# EAGLE board ROM (EAGLE 7.3.0)
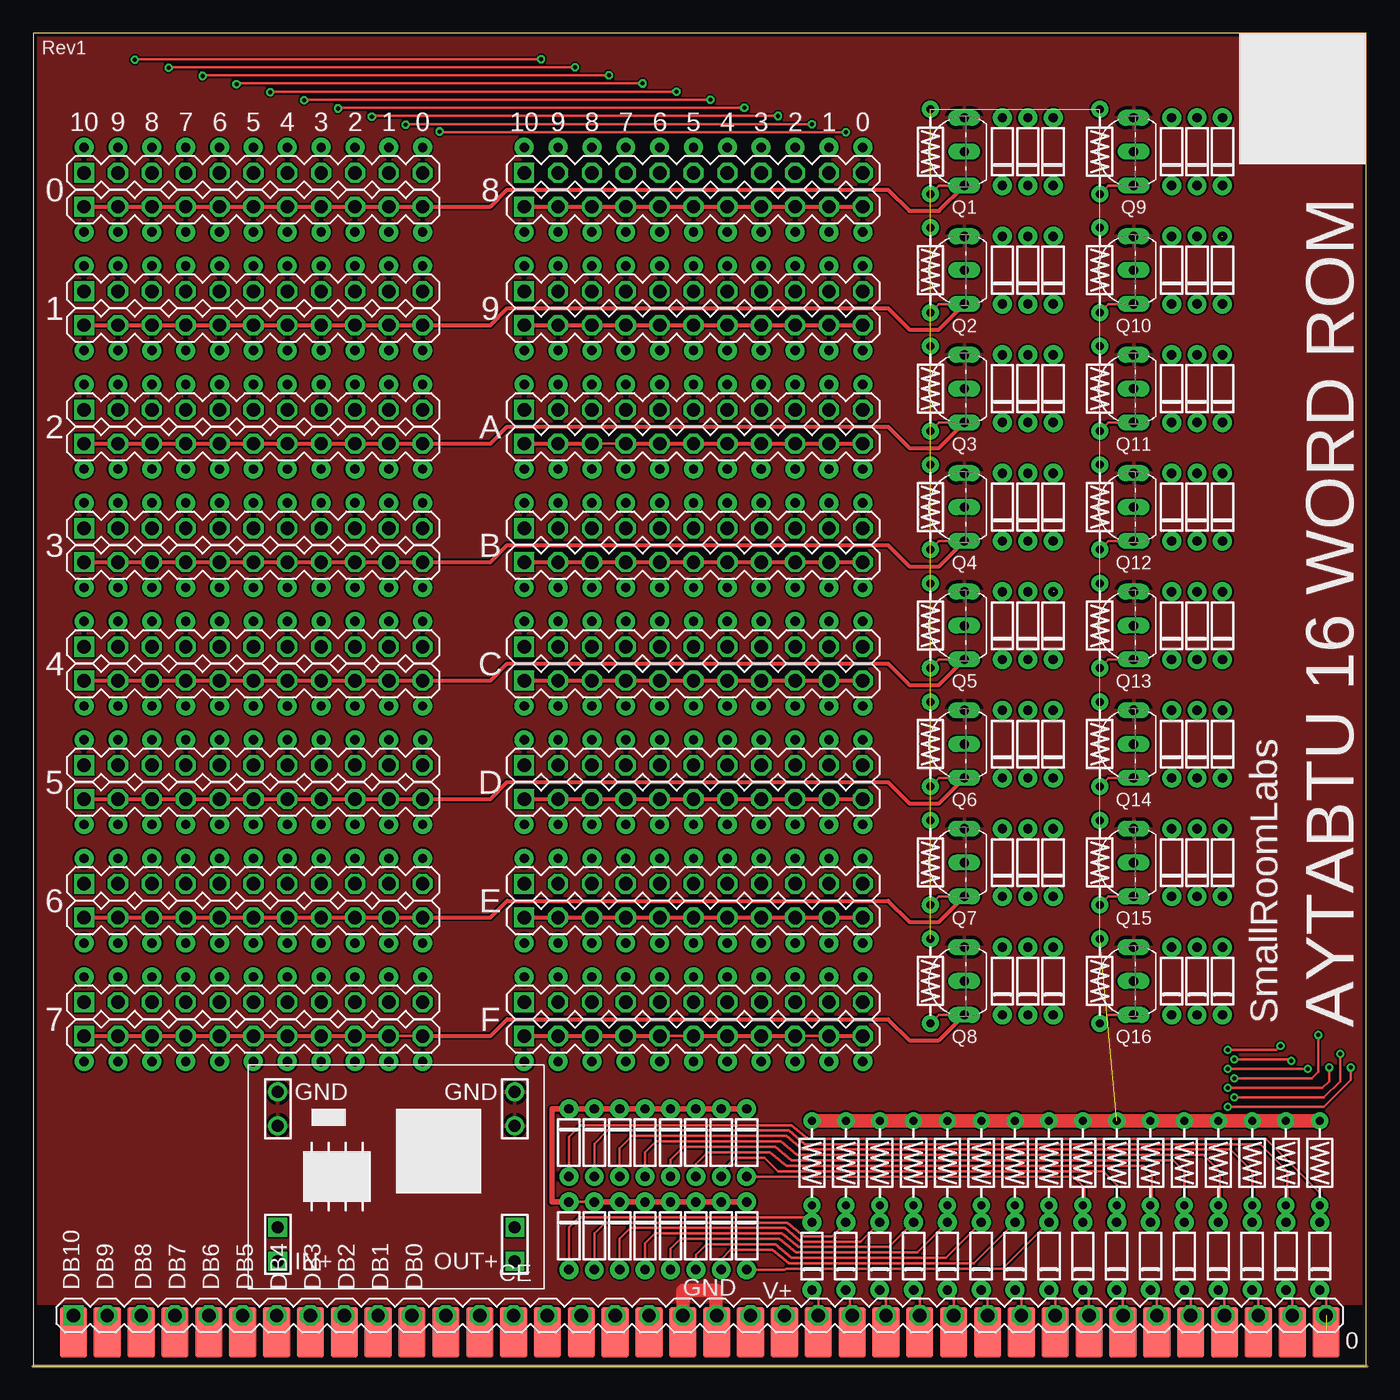
[diagram p1: board, top side]
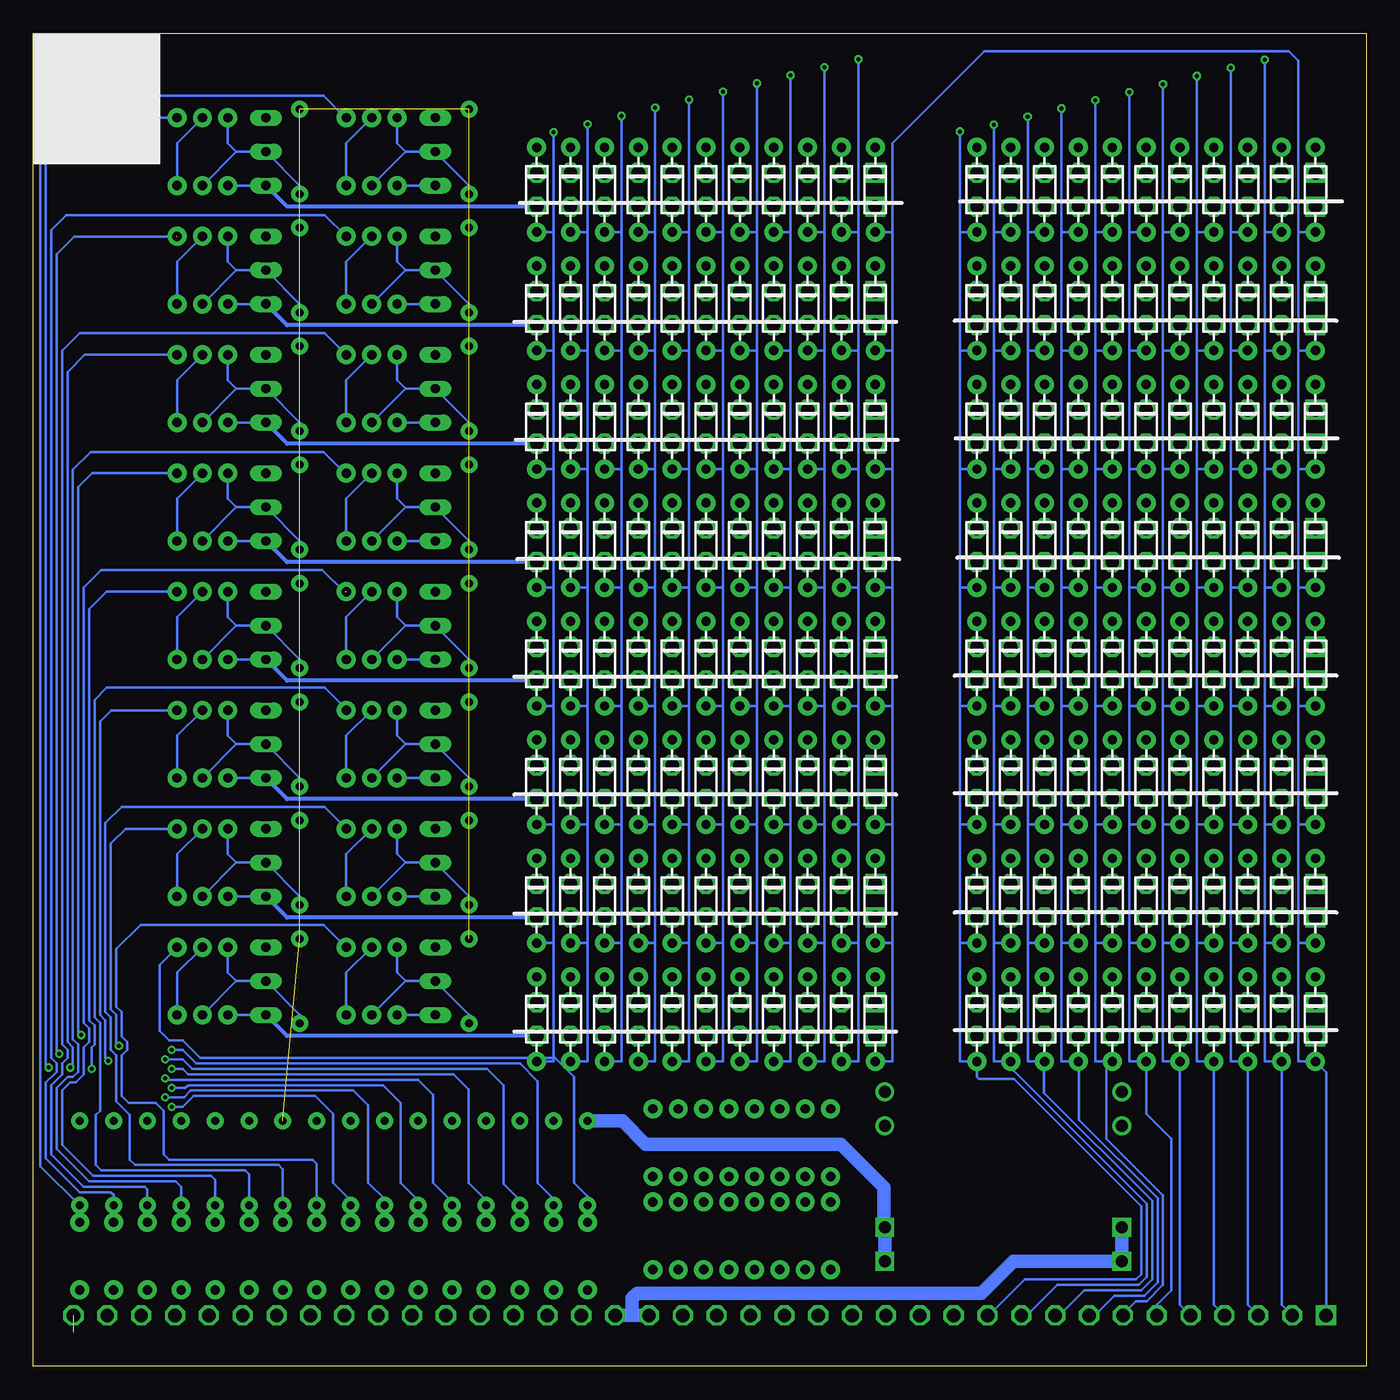
[diagram p2: board, bottom side, seen from below]

Size 100 x 100 mm. Coordinates in mm from the lower left corner, seen from the top.
Outline: 0,0 100,0 100,100 0,100 0,0
Copper layers (1*16): Top 0.035mm / dielectric 1.5mm / Bottom 0.035mm
Design rules "dirt_cheap_dirty_boards.v1": minimum track width 5mil, minimum drill 12mil, track to track 5mil, track to pad 5mil, pad to pad 5mil, via to via 5mil, smd to smd 0mil, copper to edge 10mil, drill to drill 10mil, minimum pad ring 10mil, minimum via ring 6mil, stop-mask expansion 2mil, vias tented up to drill 25mil, thermal gap 10mil

## Footprints (pad centres in the part's own frame; a part is rotated, then mirrored left to right if it is on the bottom)
HD11 = drill 1 square: P$1 -12.7,0 | drill 1 octagon: P$2 -10.16,0; P$3 -7.62,0; P$4 -5.08,0; P$5 -2.54,0; P$6 0,0; P$7 2.54,0; P$8 5.08,0; P$9 7.62,0; P$10 10.16,0; P$11 12.7,0
HD38-HOLEPAD = drill 1 square: P1@1 -46.99,0 | smd 2.032 x 3.81: P1@2 -46.99,-1.27; P2@2 -44.45,-1.27; P3@2 -41.91,-1.27; P4@2 -39.37,-1.27; P5@2 -36.83,-1.27; P6@2 -34.29,-1.27; P7@2 -31.75,-1.27; P8@2 -29.21,-1.27; P9@2 -26.67,-1.27; P10@2 -24.13,-1.27; P11@2 -21.59,-1.27; P12@2 -19.05,-1.27; P13@2 -16.51,-1.27; P14@2 -13.97,-1.27; P15@2 -11.43,-1.27; P16@2 -8.89,-1.27; P17@2 -6.35,-1.27; P18@2 -3.81,-1.27; P19@2 -1.27,-1.27; P20@2 1.27,-1.27; P21@2 3.81,-1.27; P22@2 6.35,-1.27; P23@2 8.89,-1.27; P24@2 11.43,-1.27; P25@2 13.97,-1.27; P26@2 16.51,-1.27; P27@2 19.05,-1.27; P28@2 21.59,-1.27; P29@2 24.13,-1.27; P30@2 26.67,-1.27; P31@2 29.21,-1.27; P32@2 31.75,-1.27; P33@2 34.29,-1.27; P34@2 36.83,-1.27; P35@2 39.37,-1.27; P36@2 41.91,-1.27; P37@2 44.45,-1.27; P38@2 46.99,-1.27 | drill 1 octagon: P2@1 -44.45,0; P3@1 -41.91,0; P4@1 -39.37,0; P5@1 -36.83,0; P6@1 -34.29,0; P7@1 -31.75,0; P8@1 -29.21,0; P9@1 -26.67,0; P10@1 -24.13,0; P11@1 -21.59,0; P12@1 -19.05,0; P13@1 -16.51,0; P14@1 -13.97,0; P15@1 -11.43,0; P16@1 -8.89,0; P17@1 -6.35,0; P18@1 -3.81,0; P19@1 -1.27,0; P20@1 1.27,0; P21@1 3.81,0; P22@1 6.35,0; P23@1 8.89,0; P24@1 11.43,0; P25@1 13.97,0; P26@1 16.51,0; P27@1 19.05,0; P28@1 21.59,0; P29@1 24.13,0; P30@1 26.67,0; P31@1 29.21,0; P32@1 31.75,0; P33@1 34.29,0; P34@1 36.83,0; P35@1 39.37,0; P36@1 41.91,0; P37@1 44.45,0; P38@1 46.99,0
DO35-6.3 = drill 0.7 pad 1.422: A -3.175,0; C 3.175,0
DO35-5.08 = drill 0.7 pad 1.422: A -2.54,0; C 2.54,0
TO92-S-CBE = drill 0.7 long: B 0,0; C -2.54,0; E 2.54,0
R0125-6.3 = drill 0.6 pad 1.27: 1 -3.175,0; 2 3.175,0
BUCK1722 = drill 0.9: GND@1 -8.89,6.35; GND@2 -8.89,3.81; GND@3 8.89,6.35; GND@4 8.89,3.81 | drill 0.9 square: IN@1 -8.89,-3.81; IN@2 -8.89,-6.35; OUT@1 8.89,-3.81; OUT@2 8.89,-6.35

## Placement (x,y rotation side)
CN1  HD11  [HD11]  16.51,89.53 0 top
CN2  HD11  [HD11]  16.51,87 0 top
CN3  HD11  [HD11]  16.51,80.64 0 top
CN4  HD11  [HD11]  16.51,78.11 0 top
CN5  HD11  [HD11]  16.51,71.75 0 top
CN6  HD11  [HD11]  16.51,69.22 0 top
CN7  HD11  [HD11]  16.51,53.98 0 top
CN8  HD11  [HD11]  16.51,62.87 0 top
CN9  HD11  [HD11]  16.51,60.33 0 top
CN10  HD11  [HD11]  16.51,51.44 0 top
CN11  HD11  [HD11]  49.53,89.53 0 top
CN12  HD11  [HD11]  16.51,45.09 0 top
CN13  HD11  [HD11]  16.51,42.55 0 top
CN14  HD11  [HD11]  16.51,36.2 0 top
CN15  HD11  [HD11]  16.51,33.66 0 top
CN16  HD11  [HD11]  16.51,27.3 0 top
CN17  HD11  [HD11]  16.51,24.77 0 top
CN18  HD11  [HD11]  49.53,87 0 top
CN20  HD11  [HD11]  49.53,80.64 0 top
CN21  HD11  [HD11]  49.53,78.11 0 top
CN22  HD11  [HD11]  49.53,71.75 0 top
CN23  HD11  [HD11]  49.53,69.22 0 top
CN24  HD11  [HD11]  49.53,62.87 0 top
CN25  HD11  [HD11]  49.53,60.33 0 top
CN26  HD11  [HD11]  49.53,53.98 0 top
CN27  HD11  [HD11]  49.53,51.44 0 top
CN28  HD11  [HD11]  49.53,45.09 0 top
CN29  HD11  [HD11]  49.53,42.55 0 top
CN30  HD11  [HD11]  49.53,36.2 0 top
CN31  HD11  [HD11]  49.53,33.66 0 top
CN32  HD11  [HD11]  49.53,27.3 0 top
CN33  HD11  [HD11]  49.53,24.77 0 top
CN35  HD38-HP  [HD38-HOLEPAD]  50,3.81 0 top
D1  DIODE-6.3  [DO35-6.3]  3.81,88.27 90 bottom
D2  DIODE-6.3  [DO35-6.3]  6.35,88.27 90 bottom
D3  DIODE-6.3  [DO35-6.3]  8.89,88.27 90 bottom
D4  DIODE-6.3  [DO35-6.3]  11.43,88.27 90 bottom
D5  DIODE-6.3  [DO35-6.3]  13.97,88.27 90 bottom
D6  DIODE-6.3  [DO35-6.3]  16.51,88.27 90 bottom
D7  DIODE-6.3  [DO35-6.3]  19.05,88.27 90 bottom
D8  DIODE-6.3  [DO35-6.3]  21.59,88.27 90 bottom
D9  DIODE-6.3  [DO35-6.3]  24.13,88.27 90 bottom
D10  DIODE-6.3  [DO35-6.3]  26.67,88.27 90 bottom
D11  DIODE-6.3  [DO35-6.3]  29.21,88.27 90 bottom
D12  DIODE-6.3  [DO35-6.3]  3.81,79.38 90 bottom
D13  DIODE-6.3  [DO35-6.3]  6.35,79.38 90 bottom
D14  DIODE-6.3  [DO35-6.3]  8.89,79.38 90 bottom
D15  DIODE-6.3  [DO35-6.3]  11.43,79.38 90 bottom
D16  DIODE-6.3  [DO35-6.3]  13.97,79.38 90 bottom
D17  DIODE-6.3  [DO35-6.3]  16.51,79.38 90 bottom
D18  DIODE-6.3  [DO35-6.3]  19.05,79.38 90 bottom
D19  DIODE-6.3  [DO35-6.3]  21.59,79.38 90 bottom
D20  DIODE-6.3  [DO35-6.3]  24.13,79.38 90 bottom
D21  DIODE-6.3  [DO35-6.3]  26.67,79.38 90 bottom
D22  DIODE-6.3  [DO35-6.3]  29.21,79.38 90 bottom
D23  DIODE-6.3  [DO35-6.3]  3.81,70.48 90 bottom
D24  DIODE-6.3  [DO35-6.3]  6.35,70.48 90 bottom
D25  DIODE-6.3  [DO35-6.3]  8.89,70.48 90 bottom
D26  DIODE-6.3  [DO35-6.3]  11.43,70.48 90 bottom
D27  DIODE-6.3  [DO35-6.3]  13.97,70.48 90 bottom
D28  DIODE-6.3  [DO35-6.3]  16.51,70.48 90 bottom
D29  DIODE-6.3  [DO35-6.3]  19.05,70.48 90 bottom
D30  DIODE-6.3  [DO35-6.3]  21.59,70.48 90 bottom
D31  DIODE-6.3  [DO35-6.3]  24.13,70.48 90 bottom
D32  DIODE-6.3  [DO35-6.3]  26.67,70.48 90 bottom
D33  DIODE-6.3  [DO35-6.3]  29.21,70.48 90 bottom
D34  DIODE-6.3  [DO35-6.3]  3.81,61.59 90 bottom
D35  DIODE-6.3  [DO35-6.3]  6.35,61.59 90 bottom
D36  DIODE-6.3  [DO35-6.3]  8.89,61.59 90 bottom
D37  DIODE-6.3  [DO35-6.3]  11.43,61.59 90 bottom
D38  DIODE-6.3  [DO35-6.3]  13.97,61.59 90 bottom
D39  DIODE-6.3  [DO35-6.3]  16.51,61.59 90 bottom
D40  DIODE-6.3  [DO35-6.3]  19.05,61.59 90 bottom
D41  DIODE-6.3  [DO35-6.3]  21.59,61.59 90 bottom
D42  DIODE-6.3  [DO35-6.3]  24.13,61.59 90 bottom
D43  DIODE-6.3  [DO35-6.3]  26.67,61.59 90 bottom
D44  DIODE-6.3  [DO35-6.3]  29.21,61.59 90 bottom
D45  DIODE-6.3  [DO35-6.3]  3.81,52.7 90 bottom
D46  DIODE-6.3  [DO35-6.3]  6.35,52.7 90 bottom
D47  DIODE-6.3  [DO35-6.3]  8.89,52.7 90 bottom
D48  DIODE-6.3  [DO35-6.3]  11.43,52.7 90 bottom
D49  DIODE-6.3  [DO35-6.3]  13.97,52.7 90 bottom
D50  DIODE-6.3  [DO35-6.3]  16.51,52.7 90 bottom
D51  DIODE-6.3  [DO35-6.3]  19.05,52.7 90 bottom
D52  DIODE-6.3  [DO35-6.3]  21.59,52.7 90 bottom
D53  DIODE-6.3  [DO35-6.3]  24.13,52.7 90 bottom
D54  DIODE-6.3  [DO35-6.3]  26.67,52.7 90 bottom
D55  DIODE-6.3  [DO35-6.3]  29.21,52.7 90 bottom
D56  DIODE-6.3  [DO35-6.3]  3.81,43.81 90 bottom
D57  DIODE-6.3  [DO35-6.3]  6.35,43.81 90 bottom
D58  DIODE-6.3  [DO35-6.3]  8.89,43.81 90 bottom
D59  DIODE-6.3  [DO35-6.3]  11.43,43.81 90 bottom
D60  DIODE-6.3  [DO35-6.3]  13.97,43.81 90 bottom
D61  DIODE-6.3  [DO35-6.3]  16.51,43.81 90 bottom
D62  DIODE-6.3  [DO35-6.3]  19.05,43.81 90 bottom
D63  DIODE-6.3  [DO35-6.3]  21.59,43.81 90 bottom
D64  DIODE-6.3  [DO35-6.3]  24.13,43.81 90 bottom
D65  DIODE-6.3  [DO35-6.3]  26.67,43.81 90 bottom
D66  DIODE-6.3  [DO35-6.3]  29.21,43.81 90 bottom
D67  DIODE-6.3  [DO35-6.3]  3.81,34.92 90 bottom
D68  DIODE-6.3  [DO35-6.3]  6.35,34.92 90 bottom
D69  DIODE-6.3  [DO35-6.3]  8.89,34.92 90 bottom
D70  DIODE-6.3  [DO35-6.3]  11.43,34.92 90 bottom
D71  DIODE-6.3  [DO35-6.3]  13.97,34.92 90 bottom
D72  DIODE-6.3  [DO35-6.3]  16.51,34.92 90 bottom
D73  DIODE-6.3  [DO35-6.3]  19.05,34.92 90 bottom
D74  DIODE-6.3  [DO35-6.3]  21.59,34.92 90 bottom
D75  DIODE-6.3  [DO35-6.3]  24.13,34.92 90 bottom
D76  DIODE-6.3  [DO35-6.3]  26.67,34.92 90 bottom
D77  DIODE-6.3  [DO35-6.3]  29.21,34.92 90 bottom
D78  DIODE-6.3  [DO35-6.3]  3.81,26.04 90 bottom
D79  DIODE-6.3  [DO35-6.3]  6.35,26.04 90 bottom
D80  DIODE-6.3  [DO35-6.3]  8.89,26.04 90 bottom
D81  DIODE-6.3  [DO35-6.3]  11.43,26.04 90 bottom
D82  DIODE-6.3  [DO35-6.3]  13.97,26.04 90 bottom
D83  DIODE-6.3  [DO35-6.3]  16.51,26.04 90 bottom
D84  DIODE-6.3  [DO35-6.3]  19.05,26.04 90 bottom
D85  DIODE-6.3  [DO35-6.3]  21.59,26.04 90 bottom
D86  DIODE-6.3  [DO35-6.3]  24.13,26.04 90 bottom
D87  DIODE-6.3  [DO35-6.3]  26.67,26.04 90 bottom
D88  DIODE-6.3  [DO35-6.3]  29.21,26.04 90 bottom
D89  DIODE-6.3  [DO35-6.3]  36.83,88.27 90 bottom
D90  DIODE-6.3  [DO35-6.3]  39.37,88.27 90 bottom
D91  DIODE-6.3  [DO35-6.3]  41.91,88.27 90 bottom
D92  DIODE-6.3  [DO35-6.3]  44.45,88.27 90 bottom
D93  DIODE-6.3  [DO35-6.3]  46.99,88.27 90 bottom
D94  DIODE-6.3  [DO35-6.3]  49.53,88.27 90 bottom
D95  DIODE-6.3  [DO35-6.3]  52.07,88.27 90 bottom
D96  DIODE-6.3  [DO35-6.3]  54.61,88.27 90 bottom
D97  DIODE-6.3  [DO35-6.3]  57.15,88.27 90 bottom
D98  DIODE-6.3  [DO35-6.3]  59.69,88.27 90 bottom
D99  DIODE-6.3  [DO35-6.3]  62.23,88.27 90 bottom
D100  DIODE-6.3  [DO35-6.3]  36.83,79.38 90 bottom
D101  DIODE-6.3  [DO35-6.3]  39.37,79.38 90 bottom
D102  DIODE-6.3  [DO35-6.3]  41.91,79.38 90 bottom
D103  DIODE-6.3  [DO35-6.3]  44.45,79.38 90 bottom
D104  DIODE-6.3  [DO35-6.3]  46.99,79.38 90 bottom
D105  DIODE-6.3  [DO35-6.3]  49.53,79.38 90 bottom
D106  DIODE-6.3  [DO35-6.3]  52.07,79.38 90 bottom
D107  DIODE-6.3  [DO35-6.3]  54.61,79.38 90 bottom
D108  DIODE-6.3  [DO35-6.3]  57.15,79.38 90 bottom
D109  DIODE-6.3  [DO35-6.3]  59.69,79.38 90 bottom
D110  DIODE-6.3  [DO35-6.3]  62.23,79.38 90 bottom
D111  DIODE-6.3  [DO35-6.3]  36.83,70.48 90 bottom
D112  DIODE-6.3  [DO35-6.3]  39.37,70.48 90 bottom
D113  DIODE-6.3  [DO35-6.3]  41.91,70.48 90 bottom
D114  DIODE-6.3  [DO35-6.3]  44.45,70.48 90 bottom
D115  DIODE-6.3  [DO35-6.3]  46.99,70.48 90 bottom
D116  DIODE-6.3  [DO35-6.3]  49.53,70.48 90 bottom
D117  DIODE-6.3  [DO35-6.3]  52.07,70.48 90 bottom
D118  DIODE-6.3  [DO35-6.3]  54.61,70.48 90 bottom
D119  DIODE-6.3  [DO35-6.3]  57.15,70.48 90 bottom
D120  DIODE-6.3  [DO35-6.3]  59.69,70.48 90 bottom
D121  DIODE-6.3  [DO35-6.3]  62.23,70.48 90 bottom
D122  DIODE-6.3  [DO35-6.3]  36.83,61.59 90 bottom
D123  DIODE-6.3  [DO35-6.3]  39.37,61.59 90 bottom
D124  DIODE-6.3  [DO35-6.3]  41.91,61.59 90 bottom
D125  DIODE-6.3  [DO35-6.3]  44.45,61.59 90 bottom
D126  DIODE-6.3  [DO35-6.3]  46.99,61.59 90 bottom
D127  DIODE-6.3  [DO35-6.3]  49.53,61.59 90 bottom
D128  DIODE-6.3  [DO35-6.3]  52.07,61.59 90 bottom
D129  DIODE-6.3  [DO35-6.3]  54.61,61.59 90 bottom
D130  DIODE-6.3  [DO35-6.3]  57.15,61.59 90 bottom
D131  DIODE-6.3  [DO35-6.3]  59.69,61.59 90 bottom
D132  DIODE-6.3  [DO35-6.3]  62.23,61.59 90 bottom
D133  DIODE-6.3  [DO35-6.3]  36.83,52.7 90 bottom
D134  DIODE-6.3  [DO35-6.3]  39.37,52.7 90 bottom
D135  DIODE-6.3  [DO35-6.3]  41.91,52.7 90 bottom
D136  DIODE-6.3  [DO35-6.3]  44.45,52.7 90 bottom
D137  DIODE-6.3  [DO35-6.3]  46.99,52.7 90 bottom
D138  DIODE-6.3  [DO35-6.3]  49.53,52.7 90 bottom
D139  DIODE-6.3  [DO35-6.3]  52.07,52.7 90 bottom
D140  DIODE-6.3  [DO35-6.3]  54.61,52.7 90 bottom
D141  DIODE-6.3  [DO35-6.3]  57.15,52.7 90 bottom
D142  DIODE-6.3  [DO35-6.3]  59.69,52.7 90 bottom
D143  DIODE-6.3  [DO35-6.3]  62.23,52.7 90 bottom
D144  DIODE-6.3  [DO35-6.3]  36.83,43.81 90 bottom
D145  DIODE-6.3  [DO35-6.3]  39.37,43.81 90 bottom
D146  DIODE-6.3  [DO35-6.3]  41.91,43.81 90 bottom
D147  DIODE-6.3  [DO35-6.3]  44.45,43.81 90 bottom
D148  DIODE-6.3  [DO35-6.3]  46.99,43.81 90 bottom
D149  DIODE-6.3  [DO35-6.3]  49.53,43.81 90 bottom
D150  DIODE-6.3  [DO35-6.3]  52.07,43.81 90 bottom
D151  DIODE-6.3  [DO35-6.3]  54.61,43.81 90 bottom
D152  DIODE-6.3  [DO35-6.3]  57.15,43.81 90 bottom
D153  DIODE-6.3  [DO35-6.3]  59.69,43.81 90 bottom
D154  DIODE-6.3  [DO35-6.3]  62.23,43.81 90 bottom
D155  DIODE-6.3  [DO35-6.3]  36.83,34.92 90 bottom
D156  DIODE-6.3  [DO35-6.3]  39.37,34.92 90 bottom
D157  DIODE-6.3  [DO35-6.3]  41.91,34.92 90 bottom
D158  DIODE-6.3  [DO35-6.3]  44.45,34.92 90 bottom
D159  DIODE-6.3  [DO35-6.3]  46.99,34.92 90 bottom
D160  DIODE-6.3  [DO35-6.3]  49.53,34.92 90 bottom
D161  DIODE-6.3  [DO35-6.3]  52.07,34.92 90 bottom
D162  DIODE-6.3  [DO35-6.3]  54.61,34.92 90 bottom
D163  DIODE-6.3  [DO35-6.3]  57.15,34.92 90 bottom
D164  DIODE-6.3  [DO35-6.3]  59.69,34.92 90 bottom
D165  DIODE-6.3  [DO35-6.3]  62.23,34.92 90 bottom
D166  DIODE-6.3  [DO35-6.3]  36.83,26.04 90 bottom
D167  DIODE-6.3  [DO35-6.3]  39.37,26.04 90 bottom
D168  DIODE-6.3  [DO35-6.3]  41.91,26.04 90 bottom
D169  DIODE-6.3  [DO35-6.3]  44.45,26.04 90 bottom
D170  DIODE-6.3  [DO35-6.3]  46.99,26.04 90 bottom
D171  DIODE-6.3  [DO35-6.3]  49.53,26.04 90 bottom
D172  DIODE-6.3  [DO35-6.3]  52.07,26.04 90 bottom
D173  DIODE-6.3  [DO35-6.3]  54.61,26.04 90 bottom
D174  DIODE-6.3  [DO35-6.3]  57.15,26.04 90 bottom
D175  DIODE-6.3  [DO35-6.3]  59.69,26.04 90 bottom
D176  DIODE-6.3  [DO35-6.3]  62.23,26.04 90 bottom
D177  DIODE-5.08  [DO35-5.08]  74.61,91.12 270 top
D178  DIODE-5.08  [DO35-5.08]  76.52,91.12 270 top
D179  DIODE-5.08  [DO35-5.08]  58.42,8.26 270 top
D180  DIODE-5.08  [DO35-5.08]  60.96,8.26 270 top
D181  DIODE-5.08  [DO35-5.08]  72.71,91.12 270 top
D182  DIODE-5.08  [DO35-5.08]  40.18,9.78 90 top
D183  DIODE-5.08  [DO35-5.08]  42.09,9.78 90 top
D184  DIODE-5.08  [DO35-5.08]  43.99,9.78 90 top
D185  DIODE-5.08  [DO35-5.08]  45.9,9.78 90 top
D186  DIODE-5.08  [DO35-5.08]  47.8,9.78 90 top
D187  DIODE-5.08  [DO35-5.08]  49.71,9.78 90 top
D188  DIODE-5.08  [DO35-5.08]  51.61,9.78 90 top
D189  DIODE-5.08  [DO35-5.08]  53.52,9.78 90 top
D190  DIODE-5.08  [DO35-5.08]  53.52,16.76 90 top
D191  DIODE-5.08  [DO35-5.08]  51.61,16.76 90 top
D192  DIODE-5.08  [DO35-5.08]  49.71,16.76 90 top
D193  DIODE-5.08  [DO35-5.08]  47.8,16.76 90 top
D194  DIODE-5.08  [DO35-5.08]  45.9,16.76 90 top
D195  DIODE-5.08  [DO35-5.08]  43.99,16.76 90 top
D196  DIODE-5.08  [DO35-5.08]  42.09,16.76 90 top
D197  DIODE-5.08  [DO35-5.08]  40.18,16.76 90 top
D198  DIODE-5.08  [DO35-5.08]  63.5,8.26 270 top
D199  DIODE-5.08  [DO35-5.08]  66.04,8.26 270 top
D200  DIODE-5.08  [DO35-5.08]  68.58,8.26 270 top
D201  DIODE-5.08  [DO35-5.08]  71.12,8.26 270 top
D202  DIODE-5.08  [DO35-5.08]  73.66,8.26 270 top
D203  DIODE-5.08  [DO35-5.08]  76.2,8.26 270 top
D204  DIODE-5.08  [DO35-5.08]  78.74,8.26 270 top
D205  DIODE-5.08  [DO35-5.08]  81.28,8.26 270 top
D206  DIODE-5.08  [DO35-5.08]  83.82,8.26 270 top
D207  DIODE-5.08  [DO35-5.08]  86.36,8.26 270 top
D208  DIODE-5.08  [DO35-5.08]  88.9,8.26 270 top
D209  DIODE-5.08  [DO35-5.08]  91.44,8.26 270 top
D210  DIODE-5.08  [DO35-5.08]  93.98,8.26 270 top
D211  DIODE-5.08  [DO35-5.08]  96.52,8.26 270 top
D212  DIODE-5.08  [DO35-5.08]  74.61,82.23 270 top
D213  DIODE-5.08  [DO35-5.08]  76.52,82.23 270 top
D214  DIODE-5.08  [DO35-5.08]  72.71,82.23 270 top
D215  DIODE-5.08  [DO35-5.08]  74.61,73.34 270 top
D216  DIODE-5.08  [DO35-5.08]  76.52,73.34 270 top
D217  DIODE-5.08  [DO35-5.08]  72.71,73.34 270 top
D218  DIODE-5.08  [DO35-5.08]  74.61,64.45 270 top
D219  DIODE-5.08  [DO35-5.08]  76.52,64.45 270 top
D220  DIODE-5.08  [DO35-5.08]  72.71,64.45 270 top
D221  DIODE-5.08  [DO35-5.08]  74.61,55.56 270 top
D222  DIODE-5.08  [DO35-5.08]  76.52,55.56 270 top
D223  DIODE-5.08  [DO35-5.08]  72.71,55.56 270 top
D224  DIODE-5.08  [DO35-5.08]  74.61,46.67 270 top
D225  DIODE-5.08  [DO35-5.08]  76.52,46.67 270 top
D226  DIODE-5.08  [DO35-5.08]  72.71,46.67 270 top
D227  DIODE-5.08  [DO35-5.08]  74.61,37.78 270 top
D228  DIODE-5.08  [DO35-5.08]  76.52,37.78 270 top
D229  DIODE-5.08  [DO35-5.08]  72.71,37.78 270 top
D230  DIODE-5.08  [DO35-5.08]  74.61,28.89 270 top
D231  DIODE-5.08  [DO35-5.08]  76.52,28.89 270 top
D232  DIODE-5.08  [DO35-5.08]  72.71,28.89 270 top
D233  DIODE-5.08  [DO35-5.08]  87.31,91.12 270 top
D234  DIODE-5.08  [DO35-5.08]  89.22,91.12 270 top
D235  DIODE-5.08  [DO35-5.08]  85.41,91.12 270 top
D236  DIODE-5.08  [DO35-5.08]  87.31,82.23 270 top
D237  DIODE-5.08  [DO35-5.08]  89.22,82.23 270 top
D238  DIODE-5.08  [DO35-5.08]  85.41,82.23 270 top
D239  DIODE-5.08  [DO35-5.08]  87.31,73.34 270 top
D240  DIODE-5.08  [DO35-5.08]  89.22,73.34 270 top
D241  DIODE-5.08  [DO35-5.08]  85.41,73.34 270 top
D242  DIODE-5.08  [DO35-5.08]  87.31,64.45 270 top
D243  DIODE-5.08  [DO35-5.08]  89.22,64.45 270 top
D244  DIODE-5.08  [DO35-5.08]  85.41,64.45 270 top
D245  DIODE-5.08  [DO35-5.08]  87.31,55.56 270 top
D246  DIODE-5.08  [DO35-5.08]  89.22,55.56 270 top
D247  DIODE-5.08  [DO35-5.08]  85.41,55.56 270 top
D248  DIODE-5.08  [DO35-5.08]  87.31,46.67 270 top
D249  DIODE-5.08  [DO35-5.08]  89.22,46.67 270 top
D250  DIODE-5.08  [DO35-5.08]  85.41,46.67 270 top
D251  DIODE-5.08  [DO35-5.08]  87.31,37.78 270 top
D252  DIODE-5.08  [DO35-5.08]  89.22,37.78 270 top
D253  DIODE-5.08  [DO35-5.08]  85.41,37.78 270 top
D254  DIODE-5.08  [DO35-5.08]  87.31,28.89 270 top
D255  DIODE-5.08  [DO35-5.08]  89.22,28.89 270 top
D256  DIODE-5.08  [DO35-5.08]  85.41,28.89 270 top
Q1  BC547-STRAIGHT  [TO92-S-CBE]  69.85,91.12 90 top
Q2  BC547-STRAIGHT  [TO92-S-CBE]  69.85,82.23 90 top
Q3  BC547-STRAIGHT  [TO92-S-CBE]  69.85,73.34 90 top
Q4  BC547-STRAIGHT  [TO92-S-CBE]  69.85,64.45 90 top
Q5  BC547-STRAIGHT  [TO92-S-CBE]  69.85,55.56 90 top
Q6  BC547-STRAIGHT  [TO92-S-CBE]  69.85,46.67 90 top
Q7  BC547-STRAIGHT  [TO92-S-CBE]  69.85,37.78 90 top
Q8  BC547-STRAIGHT  [TO92-S-CBE]  69.85,28.89 90 top
Q9  BC547-STRAIGHT  [TO92-S-CBE]  82.55,91.12 90 top
Q10  BC547-STRAIGHT  [TO92-S-CBE]  82.55,82.23 90 top
Q11  BC547-STRAIGHT  [TO92-S-CBE]  82.55,73.34 90 top
Q12  BC547-STRAIGHT  [TO92-S-CBE]  82.55,64.45 90 top
Q13  BC547-STRAIGHT  [TO92-S-CBE]  82.55,55.56 90 top
Q14  BC547-STRAIGHT  [TO92-S-CBE]  82.55,46.67 90 top
Q15  BC547-STRAIGHT  [TO92-S-CBE]  82.55,37.78 90 top
Q16  BC547-STRAIGHT  [TO92-S-CBE]  82.55,28.89 90 top
R1  R1/8-6MM  [R0125-6.3]  67.31,82.23 270 top
R2  R1/8-6MM  [R0125-6.3]  58.42,15.24 90 top
R3  R1/8-6MM  [R0125-6.3]  67.31,91.12 270 top
R4  R1/8-6MM  [R0125-6.3]  60.96,15.24 90 top
R5  R1/8-6MM  [R0125-6.3]  63.5,15.24 90 top
R6  R1/8-6MM  [R0125-6.3]  66.04,15.24 90 top
R7  R1/8-6MM  [R0125-6.3]  68.58,15.24 90 top
R8  R1/8-6MM  [R0125-6.3]  71.12,15.24 90 top
R9  R1/8-6MM  [R0125-6.3]  73.66,15.24 90 top
R10  R1/8-6MM  [R0125-6.3]  76.2,15.24 90 top
R11  R1/8-6MM  [R0125-6.3]  78.74,15.24 90 top
R12  R1/8-6MM  [R0125-6.3]  81.28,15.24 90 top
R13  R1/8-6MM  [R0125-6.3]  83.82,15.24 90 top
R14  R1/8-6MM  [R0125-6.3]  86.36,15.24 90 top
R15  R1/8-6MM  [R0125-6.3]  88.9,15.24 90 top
R16  R1/8-6MM  [R0125-6.3]  91.44,15.24 90 top
R17  R1/8-6MM  [R0125-6.3]  93.98,15.24 90 top
R18  R1/8-6MM  [R0125-6.3]  96.52,15.24 90 top
R19  R1/8-6MM  [R0125-6.3]  67.31,73.34 270 top
R20  R1/8-6MM  [R0125-6.3]  67.31,64.45 270 top
R21  R1/8-6MM  [R0125-6.3]  67.31,55.56 270 top
R22  R1/8-6MM  [R0125-6.3]  67.31,46.67 270 top
R23  R1/8-6MM  [R0125-6.3]  67.31,37.78 270 top
R24  R1/8-6MM  [R0125-6.3]  67.31,28.89 270 top
R25  R1/8-6MM  [R0125-6.3]  80.01,91.12 270 top
R26  R1/8-6MM  [R0125-6.3]  80.01,82.23 270 top
R27  R1/8-6MM  [R0125-6.3]  80.01,73.34 270 top
R28  R1/8-6MM  [R0125-6.3]  80.01,64.45 270 top
R29  R1/8-6MM  [R0125-6.3]  80.01,55.56 270 top
R30  R1/8-6MM  [R0125-6.3]  80.01,46.67 270 top
R31  R1/8-6MM  [R0125-6.3]  80.01,37.78 270 top
R32  R1/8-6MM  [R0125-6.3]  80.01,28.89 270 top
VR1  SMPS  [BUCK1722]  27.23,14.22 0 top

## Tracks (layer width: path | path; a pad name or v marks a point on that pad's centre or on a via)
CARDENABLE
  Top 0.203: D182.C D183.C
  Top 0.406: D183.C D184.C D185.C D186.C D187.C D188.C D189.C | D190.C D191.C D192.C D193.C D194.C D195.C D196.C D197.C 38.91,19.3 38.91,12.32 D182.C
DB0
  Top 0.203: CN35.P1@2 CN35.P1@1
  Bottom 0.203: D1.A 5.08,85.09 | 5.08,85.09 5.08,97.94 5.79,98.65 28.65,98.65 35.56,91.75 35.56,85.09 | D12.A 5.08,76.2 | 5.08,76.2 5.08,85.09 | D23.A 5.08,67.31 | 5.08,67.31 5.08,76.2 | D34.A 5.08,58.42 | 5.08,58.42 5.08,67.31 | D45.A 5.08,49.53 | 5.08,49.53 5.08,58.42 | D56.A 5.08,40.64 | 5.08,40.64 5.08,49.53 | D67.A 5.08,31.75 | 5.08,31.75 5.08,40.64 | 5.08,31.75 5.08,22.86 D78.A 3.01,22.06 CN35.P1@1 | D89.A 35.56,85.09 | D100.A 35.56,76.2 | 35.56,76.2 35.56,85.09 | D111.A 35.56,67.31 | 35.56,67.31 35.56,76.2 | D122.A 35.56,58.42 | 35.56,58.42 35.56,67.31 | D133.A 35.56,49.53 | 35.56,49.53 35.56,58.42 | D144.A 35.56,40.64 | 35.56,40.64 35.56,49.53 | D155.A 35.56,31.75 | 35.56,31.75 35.56,40.64 | D166.A 35.56,22.86 35.56,31.75
DB1  (via drill 0.3)
  Top 0.203: v7.62,98.02 7.62,98.07 v38.1,98.07 | CN35.P2@2 CN35.P2@1
  Bottom 0.203: D2.A 7.62,85.09 | 7.62,85.09 v7.62,98.02 | D13.A 7.62,76.2 | 7.62,76.2 7.62,85.09 | D24.A 7.62,67.31 | 7.62,67.31 7.62,76.2 | D35.A 7.62,58.42 | 7.62,58.42 7.62,67.31 | D46.A 7.62,49.53 | 7.62,49.53 7.62,58.42 | D57.A 7.62,40.64 | 7.62,40.64 7.62,49.53 | D68.A 7.62,31.75 | 7.62,31.75 7.62,40.64 | 7.62,31.75 7.62,22.86 D79.A 6.35,4.61 CN35.P2@1 | D90.A 38.1,85.09 | 38.1,85.09 v38.1,98.07 | D101.A 38.1,76.2 | 38.1,76.2 38.1,85.09 | D112.A 38.1,67.31 | 38.1,67.31 38.1,76.2 | D123.A 38.1,58.42 | 38.1,58.42 38.1,67.31 | D134.A 38.1,49.53 | 38.1,49.53 38.1,58.42 | D145.A 38.1,40.64 | 38.1,40.64 38.1,49.53 | D156.A 38.1,31.75 | 38.1,31.75 38.1,40.64 | D167.A 38.1,22.86 38.1,31.75
DB2  (via drill 0.3)
  Top 0.203: v10.16,97.41 10.16,97.46 v40.64,97.46 | CN35.P3@2 CN35.P3@1
  Bottom 0.203: D3.A 10.16,85.09 | 10.16,85.09 v10.16,97.41 | D14.A 10.16,76.2 | 10.16,76.2 10.16,85.09 | D25.A 10.16,67.31 | 10.16,67.31 10.16,76.2 | D36.A 10.16,58.42 | 10.16,58.42 10.16,67.31 | D47.A 10.16,49.53 | 10.16,49.53 10.16,58.42 | D58.A 10.16,40.64 | 10.16,40.64 10.16,49.53 | D69.A 10.16,31.75 | 10.16,31.75 10.16,40.64 | 10.16,31.75 10.16,22.86 D80.A 8.89,4.61 CN35.P3@1 | D91.A 40.64,85.09 | 40.64,85.09 v40.64,97.46 | D102.A 40.64,76.2 | 40.64,76.2 40.64,85.09 | D113.A 40.64,67.31 | 40.64,67.31 40.64,76.2 | D124.A 40.64,58.42 | 40.64,58.42 40.64,67.31 | D135.A 40.64,49.53 | 40.64,49.53 40.64,58.42 | D146.A 40.64,40.64 | 40.64,40.64 40.64,49.53 | D157.A 40.64,31.75 | 40.64,31.75 40.64,40.64 | D168.A 40.64,22.86 40.64,31.75
DB3  (via drill 0.3)
  Top 0.203: v12.7,96.8 12.7,96.85 v43.18,96.85 | CN35.P4@2 CN35.P4@1
  Bottom 0.203: D4.A 12.7,85.09 | 12.7,85.09 v12.7,96.8 | D15.A 12.7,76.2 | 12.7,76.2 12.7,85.09 | D26.A 12.7,67.31 | 12.7,67.31 12.7,76.2 | D37.A 12.7,58.42 | 12.7,58.42 12.7,67.31 | D48.A 12.7,49.53 | 12.7,49.53 12.7,58.42 | D59.A 12.7,40.64 | 12.7,40.64 12.7,49.53 | D70.A 12.7,31.75 | 12.7,31.75 12.7,40.64 | 12.7,31.75 12.7,22.86 D81.A 11.43,4.61 CN35.P4@1 | D92.A 43.18,85.09 | 43.18,85.09 v43.18,96.85 | D103.A 43.18,76.2 | 43.18,76.2 43.18,85.09 | D114.A 43.18,67.31 | 43.18,67.31 43.18,76.2 | D125.A 43.18,58.42 | 43.18,58.42 43.18,67.31 | D136.A 43.18,49.53 | 43.18,49.53 43.18,58.42 | D147.A 43.18,40.64 | 43.18,40.64 43.18,49.53 | D158.A 43.18,31.75 | 43.18,31.75 43.18,40.64 | D169.A 43.18,22.86 43.18,31.75
DB4  (via drill 0.3)
  Top 0.203: v15.24,96.19 15.24,96.24 v45.72,96.24 | CN35.P5@2 CN35.P5@1
  Bottom 0.203: D5.A 15.24,85.09 | 15.24,85.09 v15.24,96.19 | D16.A 15.24,76.2 | 15.24,76.2 15.24,85.09 | D27.A 15.24,67.31 | 15.24,67.31 15.24,76.2 | D38.A 15.24,58.42 | 15.24,58.42 15.24,67.31 | D49.A 15.24,49.53 | 15.24,49.53 15.24,58.42 | D60.A 15.24,40.64 | 15.24,40.64 15.24,49.53 | D71.A 15.24,31.75 | 15.24,31.75 15.24,40.64 | 15.24,31.75 15.24,22.86 D82.A 13.97,4.61 CN35.P5@1 | D93.A 45.72,85.09 | 45.72,85.09 v45.72,96.24 | D104.A 45.72,76.2 | 45.72,76.2 45.72,85.09 | D115.A 45.72,67.31 | 45.72,67.31 45.72,76.2 | D126.A 45.72,58.42 | 45.72,58.42 45.72,67.31 | D137.A 45.72,49.53 | 45.72,49.53 45.72,58.42 | D148.A 45.72,40.64 | 45.72,40.64 45.72,49.53 | D159.A 45.72,31.75 | 45.72,31.75 45.72,40.64 | D170.A 45.72,22.86 45.72,31.75
DB5  (via drill 0.3)
  Top 0.203: v17.78,95.58 17.78,95.63 v48.26,95.63 | CN35.P6@2 CN35.P6@1
  Bottom 0.203: D6.A 17.78,85.09 | 17.78,85.09 v17.78,95.58 | D17.A 17.78,76.2 | 17.78,76.2 17.78,85.09 | D28.A 17.78,67.31 | 17.78,67.31 17.78,76.2 | D39.A 17.78,58.42 | 17.78,58.42 17.78,67.31 | D50.A 17.78,49.53 | 17.78,49.53 17.78,58.42 | D61.A 17.78,40.64 | 17.78,40.64 17.78,49.53 | D72.A 17.78,31.75 | 17.78,31.75 17.78,40.64 | 17.78,31.75 17.78,22.86 D83.A 16.51,18.95 14.63,17.07 14.63,5.69 15.71,4.61 CN35.P6@1 | D94.A 48.26,85.09 | 48.26,85.09 v48.26,95.63 | D105.A 48.26,76.2 | 48.26,76.2 48.26,85.09 | D116.A 48.26,67.31 | 48.26,67.31 48.26,76.2 | D127.A 48.26,58.42 | 48.26,58.42 48.26,67.31 | D138.A 48.26,49.53 | 48.26,49.53 48.26,58.42 | D149.A 48.26,40.64 | 48.26,40.64 48.26,49.53 | D160.A 48.26,31.75 | 48.26,31.75 48.26,40.64 | D171.A 48.26,22.86 48.26,31.75
DB6  (via drill 0.3)
  Top 0.203: v20.32,94.97 20.32,95.02 v50.8,95.02 | CN35.P7@2 CN35.P7@1
  Bottom 0.203: D7.A 20.32,85.09 | 20.32,85.09 v20.32,94.97 | D18.A 20.32,76.2 | 20.32,76.2 20.32,85.09 | D29.A 20.32,67.31 | 20.32,67.31 20.32,76.2 | D40.A 20.32,58.42 | 20.32,58.42 20.32,67.31 | D51.A 20.32,49.53 | 20.32,49.53 20.32,58.42 | D62.A 20.32,40.64 | 20.32,40.64 20.32,49.53 | D73.A 20.32,31.75 | 20.32,31.75 20.32,40.64 | 20.32,31.75 20.32,22.86 D84.A 19.51,22.4 19.51,17.07 15.24,12.8 15.24,6.1 16.46,4.88 17.27,4.88 18.25,3.9 CN35.P7@1 | D95.A 50.8,85.09 | 50.8,85.09 v50.8,95.02 | D106.A 50.8,76.2 | 50.8,76.2 50.8,85.09 | D117.A 50.8,67.31 | 50.8,67.31 50.8,76.2 | D128.A 50.8,58.42 | 50.8,58.42 50.8,67.31 | D139.A 50.8,49.53 | 50.8,49.53 50.8,58.42 | D150.A 50.8,40.64 | 50.8,40.64 50.8,49.53 | D161.A 50.8,31.75 | 50.8,31.75 50.8,40.64 | D172.A 50.8,22.86 50.8,31.75
DB7  (via drill 0.3)
  Top 0.203: v22.86,94.36 22.86,94.41 v53.34,94.41 | CN35.P8@2 CN35.P8@1
  Bottom 0.203: D8.A 22.86,85.09 | 22.86,85.09 v22.86,94.36 | D19.A 22.86,76.2 | 22.86,76.2 22.86,85.09 | D30.A 22.86,67.31 | 22.86,67.31 22.86,76.2 | D41.A 22.86,58.42 | 22.86,58.42 22.86,67.31 | D52.A 22.86,49.53 | 22.86,49.53 22.86,58.42 | D63.A 22.86,40.64 | 22.86,40.64 22.86,49.53 | D74.A 22.86,31.75 | 22.86,31.75 22.86,40.64 | 22.86,31.75 22.86,22.86 D85.A 21.54,22.81 21.54,18.49 15.65,12.6 15.65,6.3 16.66,5.28 18.9,5.28 20.37,3.81 CN35.P8@1 | D96.A 53.34,85.09 | 53.34,85.09 v53.34,94.41 | D107.A 53.34,76.2 | 53.34,76.2 53.34,85.09 | D118.A 53.34,67.31 | 53.34,67.31 53.34,76.2 | D129.A 53.34,58.42 | 53.34,58.42 53.34,67.31 | D140.A 53.34,49.53 | 53.34,49.53 53.34,58.42 | D151.A 53.34,40.64 | 53.34,40.64 53.34,49.53 | D162.A 53.34,31.75 | 53.34,31.75 53.34,40.64 | D173.A 53.34,22.86 53.34,31.75
DB8  (via drill 0.3)
  Top 0.203: v25.4,93.75 25.4,93.8 v55.88,93.8 | CN35.P9@2 CN35.P9@1
  Bottom 0.203: D9.A 25.4,85.09 | 25.4,85.09 v25.4,93.75 | D20.A 25.4,76.2 | 25.4,76.2 25.4,85.09 | D31.A 25.4,67.31 | 25.4,67.31 25.4,76.2 | D42.A 25.4,58.42 | 25.4,58.42 25.4,67.31 | D53.A 25.4,49.53 | 25.4,49.53 25.4,58.42 | D64.A 25.4,40.64 | 25.4,40.64 25.4,49.53 | D75.A 25.4,31.75 | 25.4,31.75 25.4,40.64 | 25.4,31.75 25.4,22.86 D86.A 24.18,22.81 24.18,20.52 16.05,12.39 16.05,6.5 16.87,5.69 21.13,5.69 23.01,3.81 CN35.P9@1 | D97.A 55.88,85.09 | 55.88,85.09 v55.88,93.8 | D108.A 55.88,76.2 | 55.88,76.2 55.88,85.09 | D119.A 55.88,67.31 | 55.88,67.31 55.88,76.2 | D130.A 55.88,58.42 | 55.88,58.42 55.88,67.31 | D141.A 55.88,49.53 | 55.88,49.53 55.88,58.42 | D152.A 55.88,40.64 | 55.88,40.64 55.88,49.53 | D163.A 55.88,31.75 | 55.88,31.75 55.88,40.64 | D174.A 55.88,22.86 55.88,31.75
DB9  (via drill 0.3)
  Top 0.203: v27.94,93.14 27.94,93.19 v58.42,93.19 | CN35.P10@2 CN35.P10@1
  Bottom 0.203: D10.A 27.94,85.09 | 27.94,85.09 v27.94,93.14 | D21.A 27.94,76.2 | 27.94,76.2 27.94,85.09 | D32.A 27.94,67.31 | 27.94,67.31 27.94,76.2 | D43.A 27.94,58.42 | 27.94,58.42 27.94,67.31 | D54.A 27.94,49.53 | 27.94,49.53 27.94,58.42 | D65.A 27.94,40.64 | 27.94,40.64 27.94,49.53 | D76.A 27.94,31.75 | 27.94,31.75 27.94,40.64 | 27.94,31.75 27.94,22.86 D87.A 26.42,22.61 26.42,22.15 16.46,12.19 16.46,6.71 17.07,6.1 23.16,6.1 25.45,3.81 CN35.P10@1 | D98.A 58.42,85.09 | 58.42,85.09 v58.42,93.19 | D109.A 58.42,76.2 | 58.42,76.2 58.42,85.09 | D120.A 58.42,67.31 | 58.42,67.31 58.42,76.2 | D131.A 58.42,58.42 | 58.42,58.42 58.42,67.31 | D142.A 58.42,49.53 | 58.42,49.53 58.42,58.42 | D153.A 58.42,40.64 | 58.42,40.64 58.42,49.53 | D164.A 58.42,31.75 | 58.42,31.75 58.42,40.64 | D175.A 58.42,22.86 58.42,31.75
DB10  (via drill 0.3)
  Top 0.203: v30.48,92.63 30.48,92.58 v60.96,92.58 | CN35.P11@2 CN35.P11@1
  Bottom 0.203: D11.A 30.48,85.09 | 30.48,85.09 v30.48,92.63 | D22.A 30.48,76.2 | 30.48,76.2 30.48,85.09 | D33.A 30.48,67.31 | 30.48,67.31 30.48,76.2 | D44.A 30.48,58.42 | 30.48,58.42 30.48,67.31 | D55.A 30.48,49.53 | 30.48,49.53 30.48,58.42 | D66.A 30.48,40.64 | 30.48,40.64 30.48,49.53 | D77.A 30.48,31.75 | 30.48,31.75 30.48,40.64 | 30.48,31.75 30.48,22.86 D88.A 29.21,21.69 29.06,21.54 26.42,21.54 16.87,11.99 16.87,6.91 17.27,6.5 25.6,6.5 28.3,3.81 CN35.P11@1 | D99.A 60.96,85.09 | 60.96,85.09 v60.96,92.58 60.96,92.63 | D110.A 60.96,76.2 | 60.96,76.2 60.96,85.09 | D121.A 60.96,67.31 | 60.96,67.31 60.96,76.2 | D132.A 60.96,58.42 | 60.96,58.42 60.96,67.31 | D143.A 60.96,49.53 | 60.96,49.53 60.96,58.42 | D154.A 60.96,40.64 | 60.96,40.64 60.96,49.53 | D165.A 60.96,31.75 | 60.96,31.75 60.96,40.64 | D176.A 60.96,22.86 60.96,31.75
GND
  Top 1.016: CN35.P19@2 CN35.P19@1 48.73,5.65 48.77,5.69 51.21,5.69 51.21,3.87 CN35.P20@1 CN35.P20@2
  pour Top: 0,4.67 100.33,4.67 100.33,99.69 0,99.69
N$1
  Bottom 0.203: D1.C CN1.P$1
N$2
  Bottom 0.203: D2.C CN1.P$2
N$3
  Bottom 0.203: D3.C CN1.P$3
N$4
  Bottom 0.203: D4.C CN1.P$4
N$5
  Bottom 0.203: D5.C CN1.P$5
N$6
  Bottom 0.203: D6.C CN1.P$6
N$7
  Bottom 0.203: D7.C CN1.P$7
N$8
  Bottom 0.203: D8.C CN1.P$8
N$9
  Bottom 0.203: D9.C CN1.P$9
N$10
  Bottom 0.203: D10.C CN1.P$10
N$11
  Bottom 0.203: D11.C CN1.P$11
N$12
  Bottom 0.203: D12.C CN3.P$1
N$13
  Bottom 0.203: D13.C CN3.P$2
N$14
  Bottom 0.203: D14.C CN3.P$3
N$15
  Bottom 0.203: D15.C CN3.P$4
N$16
  Bottom 0.203: D16.C CN3.P$5
N$17
  Bottom 0.203: D17.C CN3.P$6
N$18
  Bottom 0.203: D18.C CN3.P$7
N$19
  Bottom 0.203: D19.C CN3.P$8
N$20
  Bottom 0.203: D20.C CN3.P$9
N$21
  Bottom 0.203: D21.C CN3.P$10
N$22
  Bottom 0.203: D22.C CN3.P$11
N$23
  Bottom 0.203: D23.C CN5.P$1
N$24
  Bottom 0.203: D24.C CN5.P$2
N$25
  Bottom 0.203: D25.C CN5.P$3
N$26
  Bottom 0.203: D26.C CN5.P$4
N$27
  Bottom 0.203: D27.C CN5.P$5
N$28
  Bottom 0.203: D28.C CN5.P$6
N$29
  Bottom 0.203: D29.C CN5.P$7
N$30
  Bottom 0.203: D30.C CN5.P$8
N$31
  Bottom 0.203: D31.C CN5.P$9
N$32
  Bottom 0.203: D32.C CN5.P$10
N$33
  Bottom 0.203: D33.C CN5.P$11
N$34
  Bottom 0.203: D34.C CN8.P$1
N$35
  Bottom 0.203: D35.C CN8.P$2
N$36
  Bottom 0.203: D36.C CN8.P$3
N$37
  Bottom 0.203: D37.C CN8.P$4
N$38
  Bottom 0.203: D38.C CN8.P$5
N$39
  Bottom 0.203: D39.C CN8.P$6
N$40
  Bottom 0.203: D40.C CN8.P$7
N$41
  Bottom 0.203: D41.C CN8.P$8
N$42
  Bottom 0.203: D42.C CN8.P$9
N$43
  Bottom 0.203: D43.C CN8.P$10
N$44
  Bottom 0.203: D44.C CN8.P$11
N$45
  Bottom 0.203: D45.C CN7.P$1
N$46
  Bottom 0.203: D46.C CN7.P$2
N$47
  Bottom 0.203: D47.C CN7.P$3
N$48
  Bottom 0.203: D48.C CN7.P$4
N$49
  Bottom 0.203: D49.C CN7.P$5
N$50
  Bottom 0.203: D50.C CN7.P$6
N$51
  Bottom 0.203: D51.C CN7.P$7
N$52
  Bottom 0.203: D52.C CN7.P$8
N$53
  Bottom 0.203: D53.C CN7.P$9
N$54
  Bottom 0.203: D54.C CN7.P$10
N$55
  Bottom 0.203: D55.C CN7.P$11
N$56
  Bottom 0.203: D56.C CN12.P$1
N$57
  Bottom 0.203: D57.C CN12.P$2
N$58
  Bottom 0.203: D58.C CN12.P$3
N$59
  Bottom 0.203: D59.C CN12.P$4
N$60
  Bottom 0.203: D60.C CN12.P$5
N$61
  Bottom 0.203: D61.C CN12.P$6
N$62
  Bottom 0.203: D62.C CN12.P$7
N$63
  Bottom 0.203: D63.C CN12.P$8
N$64
  Bottom 0.203: D64.C CN12.P$9
N$65
  Bottom 0.203: D65.C CN12.P$10
N$66
  Bottom 0.203: D66.C CN12.P$11
N$67
  Bottom 0.203: D67.C CN14.P$1
N$68
  Bottom 0.203: D68.C CN14.P$2
N$69
  Bottom 0.203: D69.C CN14.P$3
N$70
  Bottom 0.203: D70.C CN14.P$4
N$71
  Bottom 0.203: D71.C CN14.P$5
N$72
  Bottom 0.203: D72.C CN14.P$6
N$73
  Bottom 0.203: D73.C CN14.P$7
N$74
  Bottom 0.203: D74.C CN14.P$8
N$75
  Bottom 0.203: D75.C CN14.P$9
N$76
  Bottom 0.203: D76.C CN14.P$10
N$77
  Bottom 0.203: D77.C CN14.P$11
N$78
  Bottom 0.203: D78.C CN16.P$1
N$79
  Bottom 0.203: D79.C CN16.P$2
N$80
  Bottom 0.203: D80.C CN16.P$3
N$81
  Bottom 0.203: D81.C CN16.P$4
N$82
  Bottom 0.203: D82.C CN16.P$5
N$83
  Bottom 0.203: D83.C CN16.P$6
N$84
  Bottom 0.203: D84.C CN16.P$7
N$85
  Bottom 0.203: D85.C CN16.P$8
N$86
  Bottom 0.203: D86.C CN16.P$9
N$87
  Bottom 0.203: D87.C CN16.P$10
N$88
  Bottom 0.203: D88.C CN16.P$11
N$89
  Bottom 0.203: D89.C CN11.P$1
N$90
  Bottom 0.203: D90.C CN11.P$2
N$91
  Bottom 0.203: D91.C CN11.P$3
N$92
  Bottom 0.203: D92.C CN11.P$4
N$93
  Bottom 0.203: D93.C CN11.P$5
N$94
  Bottom 0.203: D94.C CN11.P$6
N$95
  Bottom 0.203: D95.C CN11.P$7
N$96
  Bottom 0.203: D96.C CN11.P$8
N$97
  Bottom 0.203: D97.C CN11.P$9
N$98
  Bottom 0.203: D98.C CN11.P$10
N$99
  Bottom 0.203: D99.C CN11.P$11
N$100
  Bottom 0.203: D100.C CN20.P$1
N$101
  Bottom 0.203: D101.C CN20.P$2
N$102
  Bottom 0.203: D102.C CN20.P$3
N$103
  Bottom 0.203: D103.C CN20.P$4
N$104
  Bottom 0.203: D104.C CN20.P$5
N$105
  Bottom 0.203: D105.C CN20.P$6
N$106
  Bottom 0.203: D106.C CN20.P$7
N$107
  Bottom 0.203: D107.C CN20.P$8
N$108
  Bottom 0.203: D108.C CN20.P$9
N$109
  Bottom 0.203: D109.C CN20.P$10
N$110
  Bottom 0.203: D110.C CN20.P$11
N$111
  Bottom 0.203: D111.C CN22.P$1
N$112
  Bottom 0.203: D112.C CN22.P$2
N$113
  Bottom 0.203: D113.C CN22.P$3
N$114
  Bottom 0.203: D114.C CN22.P$4
N$115
  Bottom 0.203: D115.C CN22.P$5
N$116
  Bottom 0.203: D116.C CN22.P$6
N$117
  Bottom 0.203: D117.C CN22.P$7
N$118
  Bottom 0.203: D118.C CN22.P$8
N$119
  Bottom 0.203: D119.C CN22.P$9
N$120
  Bottom 0.203: D120.C CN22.P$10
N$121
  Bottom 0.203: D121.C CN22.P$11
N$122
  Bottom 0.203: D122.C CN24.P$1
N$123
  Bottom 0.203: D123.C CN24.P$2
N$124
  Bottom 0.203: D124.C CN24.P$3
N$125
  Bottom 0.203: D125.C CN24.P$4
N$126
  Bottom 0.203: D126.C CN24.P$5
N$127
  Bottom 0.203: D127.C CN24.P$6
N$128
  Bottom 0.203: D128.C CN24.P$7
N$129
  Bottom 0.203: D129.C CN24.P$8
N$130
  Bottom 0.203: D130.C CN24.P$9
N$131
  Bottom 0.203: D131.C CN24.P$10
N$132
  Bottom 0.203: D132.C CN24.P$11
N$133
  Bottom 0.203: D133.C CN26.P$1
N$134
  Bottom 0.203: D134.C CN26.P$2
N$135
  Bottom 0.203: D135.C CN26.P$3
N$136
  Bottom 0.203: D136.C CN26.P$4
N$137
  Bottom 0.203: D137.C CN26.P$5
N$138
  Bottom 0.203: D138.C CN26.P$6
N$139
  Bottom 0.203: D139.C CN26.P$7
N$140
  Bottom 0.203: D140.C CN26.P$8
N$141
  Bottom 0.203: D141.C CN26.P$9
N$142
  Bottom 0.203: D142.C CN26.P$10
N$143
  Bottom 0.203: D143.C CN26.P$11
N$144
  Bottom 0.203: D144.C CN28.P$1
N$145
  Bottom 0.203: D145.C CN28.P$2
N$146
  Bottom 0.203: D146.C CN28.P$3
N$147
  Bottom 0.203: D147.C CN28.P$4
N$148
  Bottom 0.203: D148.C CN28.P$5
N$149
  Bottom 0.203: D149.C CN28.P$6
N$150
  Bottom 0.203: D150.C CN28.P$7
N$151
  Bottom 0.203: D151.C CN28.P$8
N$152
  Bottom 0.203: D152.C CN28.P$9
N$153
  Bottom 0.203: D153.C CN28.P$10
N$154
  Bottom 0.203: D154.C CN28.P$11
N$155
  Bottom 0.203: D155.C CN30.P$1
N$156
  Bottom 0.203: D156.C CN30.P$2
N$157
  Bottom 0.203: D157.C CN30.P$3
N$158
  Bottom 0.203: D158.C CN30.P$4
N$159
  Bottom 0.203: D159.C CN30.P$5
N$160
  Bottom 0.203: D160.C CN30.P$6
N$161
  Bottom 0.203: D161.C CN30.P$7
N$162
  Bottom 0.203: D162.C CN30.P$8
N$163
  Bottom 0.203: D163.C CN30.P$9
N$164
  Bottom 0.203: D164.C CN30.P$10
N$165
  Bottom 0.203: D165.C CN30.P$11
N$166
  Bottom 0.203: D166.C CN32.P$1
N$167
  Bottom 0.203: D167.C CN32.P$2
N$168
  Bottom 0.203: D168.C CN32.P$3
N$169
  Bottom 0.203: D169.C CN32.P$4
N$170
  Bottom 0.203: D170.C CN32.P$5
N$171
  Bottom 0.203: D171.C CN32.P$6
N$172
  Bottom 0.203: D172.C CN32.P$7
N$173
  Bottom 0.203: D173.C CN32.P$8
N$174
  Bottom 0.203: D174.C CN32.P$9
N$175
  Bottom 0.203: D175.C CN32.P$10
N$176
  Bottom 0.203: D176.C CN32.P$11
N$177
  Bottom 0.203: D215.A 76.52,73.98 D216.C
N$178
  Bottom 0.203: 72.07,91.12 Q1.B 67.31,88.58 | 72.07,91.12 D177.C | 72.07,91.12 72.71,91.76 D181.A
N$179
  Bottom 0.203: D178.C 76.52,91.76 D177.A
N$180
  Bottom 0.203: 72.07,82.23 Q2.B 67.31,79.69 | 72.07,82.23 D212.C | 72.07,82.23 72.71,82.87 D214.A
N$181
  Bottom 0.203: D213.C 76.52,82.87 D212.A
N$182
  Bottom 0.203: 72.07,73.34 Q3.B 67.31,70.8 | 72.07,73.34 D215.C | 72.07,73.34 72.71,73.98 D217.A
N$183
  Bottom 0.203: D242.A 89.22,65.09 D243.C
N$184
  Bottom 0.203: 72.07,64.45 Q4.B 67.31,61.91 | 72.07,64.45 D218.C | 72.07,64.45 72.71,65.09 D220.A
N$185
  Bottom 0.203: D219.C 76.52,65.09 D218.A
N$186
  Bottom 0.203: 72.07,55.56 Q5.B 67.31,53.02 | 72.07,55.56 D221.C | 72.07,55.56 72.71,56.2 D223.A
N$187
  Bottom 0.203: D222.C 76.52,56.2 D221.A
N$188
  Bottom 0.203: 67.31,44.13 Q6.B 72.07,46.67 | 72.07,46.67 D224.C | 72.07,46.67 72.71,47.31 D226.A
N$189
  Bottom 0.203: D225.C 76.52,47.31 D224.A
N$190
  Bottom 0.203: 67.31,35.24 Q7.B 72.07,37.78 | 72.07,37.78 D227.C | 72.07,37.78 72.71,38.42 D229.A
N$191
  Bottom 0.203: D228.C 76.52,38.42 D227.A
N$192
  Bottom 0.203: 67.31,26.35 Q8.B 72.07,28.89 | 72.07,28.89 D230.C | 72.07,28.89 72.71,29.53 D232.A
N$193
  Bottom 0.203: D231.C 76.52,29.53 D230.A
N$194
  Bottom 0.203: 80.01,88.58 Q9.B 84.77,91.12 | 84.77,91.12 D233.C | 84.77,91.12 85.41,91.76 D235.A
N$195
  Bottom 0.203: D234.C 89.22,91.76 D233.A
N$196
  Bottom 0.203: 80.01,79.69 Q10.B 84.77,82.23 | 84.77,82.23 D236.C | 84.77,82.23 85.41,82.87 D238.A
N$198
  Bottom 0.203: 84.77,73.34 Q11.B 80.01,70.8 | 84.77,73.34 D239.C | 84.77,73.34 85.41,73.98 D241.A
N$199
  Bottom 0.203: D240.C 89.22,73.98 D239.A
N$200
  Bottom 0.203: 84.77,64.45 Q12.B 80.01,61.91 | 84.77,64.45 D242.C | 84.77,64.45 85.41,65.09 D244.A
N$201
  Bottom 0.203: D251.A 89.22,38.42 D252.C
N$202
  Bottom 0.203: 84.77,55.56 Q13.B 80.01,53.02 | 84.77,55.56 D245.C | 84.77,55.56 85.41,56.2 D247.A
N$203
  Bottom 0.203: D236.A 89.22,82.87 D237.C
N$204
  Bottom 0.203: 84.77,46.67 Q14.B 80.01,44.13 | 84.77,46.67 D248.C | 84.77,46.67 85.41,47.31 D250.A
N$205
  Bottom 0.203: D245.A 89.22,56.2 D246.C
N$206
  Bottom 0.203: 84.77,37.78 Q15.B 80.01,35.24 | 84.77,37.78 D251.C | 84.77,37.78 85.41,38.42 D253.A
N$207
  Bottom 0.203: D248.A 89.22,47.31 D249.C
N$208
  Bottom 0.203: 84.77,28.89 Q16.B 80.01,26.35 | 84.77,28.89 D254.C | 84.77,28.89 85.41,29.53 D256.A
N$209
  Bottom 0.203: D255.C 89.22,29.53 D254.A
RE0
  Top 0.203: D211.A R18.1 96.52,13.01 92.46,17.07 58.12,17.07 56.9,18.09 41.05,18.09 40.18,17.22 D197.A
  Bottom 0.203: R18.1 99.47,15.01 99.47,94.08 98.25,95.3 78.23,95.3 76.59,93.66 D178.A
RE1
  Top 0.203: D210.A R17.1 94.08,12.17 94.08,14.63 92.05,16.66 57.91,16.66 56.69,17.68 43.08,17.68 42.09,16.69 D196.A
  Bottom 0.203: R17.1 93.98,12.85 94.18,13.06 96.52,13.06 99.06,15.6 99.06,21.29 98.25,22.1 98.25,22.71 98.65,23.11 98.65,85.24 97.54,86.36 78.13,86.36 76.54,84.77 D213.A
RE2
  Top 0.203: D209.A R16.1 91.44,14.63 89.81,16.26 57.71,16.26 56.49,17.27 44.91,17.27 43.99,16.36 D195.A
  Bottom 0.203: R16.1 91.44,13.26 91.64,13.46 96.22,13.46 98.65,15.9 98.65,21.08 97.84,21.89 97.84,22.71 97.43,23.11 97.43,23.72 97.84,24.13 97.84,76.2 96.52,77.52 78.13,77.52 76.52,75.91 D216.A
RE3
  Top 0.203: D208.A R15.1 89,12.17 89,14.63 87.78,15.85 57.3,15.85 56.08,16.87 46.74,16.87 45.9,16.03 D194.A
  Bottom 0.203: R15.1 88.9,13.46 89.31,13.87 95.81,13.87 98.25,16.31 98.25,20.88 97.43,21.69 97.03,21.69 96.62,22.1 96.62,24.13 97.03,24.54 97.03,67.26 95.71,68.58 78.23,68.58 76.64,66.99 D219.A
RE4  (1 unrouted)
  Top 0.203: D207.A R14.1 86.36,14.63 85.55,15.44 56.9,15.44 55.68,16.46 48.77,16.46 47.8,15.49 D193.A
  Bottom 0.203: R14.1 86.36,13.97 86.67,14.28 95.5,14.28 97.84,16.61 97.84,20.68 97.23,21.29 96.83,21.29 96.22,21.89 96.22,23.93 95.81,24.33 95.81,25.35 96.22,25.76 96.22,58.42 94.89,59.74 78.33,59.74 76.69,58.1 76.61,58.1
RE5
  Top 0.203: D206.A R13.1 83.92,12.17 83.92,14.43 83.31,15.04 56.49,15.04 55.27,16.05 50.6,16.05 49.71,15.16 D192.A
  Bottom 0.203: R13.1 83.82,14.38 84.12,14.68 94.89,14.68 95.3,15.09 95.3,18.85 95,19.15 95,25.76 95.4,26.16 95.4,49.99 94.49,50.9 78.13,50.9 76.52,49.29 D225.A
RE6
  Top 0.203: D205.A R12.1 81.28,13.61 80.26,14.63 55.88,14.63 54.86,15.65 52.63,15.65 51.61,14.63 D191.A
  Bottom 0.203: R12.1 81.28,14.78 81.58,15.09 92.35,15.09 92.76,15.49 92.76,18.85 93.78,19.86 93.78,23.32 94.18,23.72 94.18,26.16 94.59,26.57 94.59,40.74 93.37,41.96 78.13,41.96 76.52,40.35 D228.A
RE7
  Top 0.203: D204.A R11.1 78.84,12.17 78.84,13.41 78.03,14.22 D190.A
  Bottom 0.203: R11.1 78.74,15.19 79.05,15.49 89.81,15.49 90.22,15.9 90.22,19.15 90.83,19.76 92.86,19.76 93.37,20.27 93.37,23.32 92.96,23.72 92.96,24.33 93.37,24.74 93.37,26.57 93.78,26.98 93.78,31.29 91.95,33.12 78.23,33.12 76.54,31.43 D231.A
RE8  (via drill 0.3)
  Top 0.203: R10.1 D203.A 72.72,7.32 56.49,7.32 56.36,7.24 D189.A | v89.61,19.46 96.83,19.46 98.86,21.49 v98.86,22.4
  Bottom 0.203: v89.61,19.46 88.8,19.46 87.99,20.27 78.84,20.27 77.52,18.95 77.52,13.77 76.2,12.45 R10.1 | v98.86,22.4 99.06,22.61 99.06,92.76 98.16,93.66 D234.A
RE9  (via drill 0.3)  (1 unrouted)
  Top 0.203: R9.1 D202.A 70.59,7.72 56.69,7.72 55.47,8.74 52.32,8.74 51.61,8.03 D188.A | v90.12,20.17 96.83,20.17 98.04,21.39 v98.04,23.42
  Bottom 0.203: v90.12,20.17 88.7,20.17 88.19,20.68 76,20.68 74.88,19.56 74.88,13.77 73.66,12.55 R9.1 | v98.04,23.42 98.25,23.62 98.25,83.41 96.93,84.73 89.22,84.73
RE10  (via drill 0.3)
  Top 0.203: R8.1 D201.A 68.45,8.13 56.9,8.13 55.68,9.14 50.49,9.14 49.71,8.36 D187.A | v89.61,20.88 96.72,20.88 97.23,21.39 v97.23,22.4
  Bottom 0.203: v89.61,20.88 88.59,20.88 88.39,21.08 73.76,21.08 72.44,19.76 72.44,13.77 71.12,12.45 R8.1 | v97.23,22.4 97.03,22.61 97.03,23.93 97.43,24.33 97.43,74.57 96.13,75.88 D240.A
RE11  (via drill 0.3)
  Top 0.203: R7.1 D200.A 66.32,8.53 57.2,8.53 55.98,9.55 48.56,9.55 47.8,8.79 D186.A | v90.12,21.59 95.91,21.59 96.42,22.1 v96.42,24.84
  Bottom 0.203: v90.12,21.59 90.02,21.49 71.12,21.49 70,20.37 70,13.77 68.58,12.34 R7.1 | v96.42,24.84 96.62,25.04 96.62,65.94 95.57,66.99 D243.A
RE12  (via drill 0.3)
  Top 0.203: R6.1 D199.A 64.19,8.94 57.4,8.94 56.19,9.96 46.63,9.96 45.9,9.22 D185.A | v89.61,22.3 v95.61,22.3
  Bottom 0.203: v89.61,22.3 88.8,22.3 88.39,21.89 68.48,21.89 67.36,20.78 67.36,13.77 66.04,12.45 R6.1 | v95.61,22.3 95.61,23.93 95.4,24.13 95.4,25.55 95.81,25.96 95.81,56.79 94.5,58.1 D246.A
RE13  (via drill 0.3)
  Top 0.203: R5.1 D198.A 62.05,9.35 57.61,9.35 56.39,10.36 44.81,10.36 43.99,9.55 D184.A | v90.12,23.01 94.28,23.01 v94.39,22.91
  Bottom 0.203: v90.12,23.01 88.8,23.01 88.09,22.3 65.94,22.3 64.72,21.08 64.72,13.66 63.5,12.45 R5.1 | v94.39,22.91 94.59,23.11 94.59,25.96 95,26.36 95,48.36 94.14,49.21 D249.A
RE14  (via drill 0.3)
  Top 0.203: R4.1 D180.A 59.92,9.75 57.81,9.75 56.59,10.77 42.88,10.77 42.09,9.98 D183.A | v89.61,23.72 93.27,23.72 v93.57,24.03
  Bottom 0.203: v89.61,23.72 88.8,23.72 87.78,22.71 63.5,22.71 62.18,21.39 62.18,13.77 60.96,12.55 R4.1 | v93.57,24.03 93.78,24.23 93.78,26.36 94.18,26.77 94.18,39.22 93.08,40.32 D252.A
RE15
  Top 0.203: D182.A 40.18,10.41 40.95,11.18 58.04,11.18 D179.A R2.1
  Bottom 0.203: D255.A 90.53,30.12 90.53,25.15 89.81,24.43 88.8,24.43 87.48,23.11 60.86,23.11 59.44,21.69 59.44,13.77 58.42,12.75 R2.1
ROW0
  Top 0.203: R3.2 67.94,88.58 Q1.C
  Top 0.305: CN2.P$1 CN2.P$2 CN2.P$3 CN2.P$4 CN2.P$5 CN2.P$6 CN2.P$7 CN2.P$8 CN2.P$9 CN2.P$10 CN2.P$11 34.29,87 35.56,88.27 64.14,88.27 65.72,86.68 67.94,86.68 Q1.C
  Bottom 0.203: Q1.C D181.C
ROW1
  Top 0.203: R1.2 67.94,79.69 Q2.C
  Top 0.305: CN4.P$1 CN4.P$2 CN4.P$3 CN4.P$4 CN4.P$5 CN4.P$6 CN4.P$7 CN4.P$8 CN4.P$9 CN4.P$10 CN4.P$11 34.29,78.11 35.56,79.38 64.14,79.38 65.72,77.79 67.94,77.79 Q2.C
  Bottom 0.203: Q2.C D214.C
ROW2
  Top 0.203: R19.2 67.94,70.8 Q3.C
  Top 0.305: CN6.P$1 CN6.P$2 CN6.P$3 CN6.P$4 CN6.P$5 CN6.P$6 CN6.P$7 CN6.P$8 CN6.P$9 CN6.P$10 CN6.P$11 34.29,69.22 35.56,70.48 64.14,70.48 65.72,68.9 67.94,68.9 Q3.C
  Bottom 0.203: D217.C Q3.C
ROW3
  Top 0.203: R20.2 67.94,61.91 Q4.C
  Top 0.305: CN9.P$1 CN9.P$2 CN9.P$3 CN9.P$4 CN9.P$5 CN9.P$6 CN9.P$7 CN9.P$8 CN9.P$9 CN9.P$10 CN9.P$11 34.29,60.33 35.56,61.59 64.14,61.59 65.72,60.01 67.94,60.01 Q4.C
  Bottom 0.203: Q4.C D220.C
ROW4
  Top 0.203: R21.2 67.94,53.02 Q5.C
  Top 0.305: CN10.P$1 CN10.P$2 CN10.P$3 CN10.P$4 CN10.P$5 CN10.P$6 CN10.P$7 CN10.P$8 CN10.P$9 CN10.P$10 CN10.P$11 34.29,51.44 35.56,52.7 64.14,52.7 65.72,51.12 67.94,51.12 Q5.C
  Bottom 0.203: D223.C Q5.C
ROW5
  Top 0.203: R22.2 67.94,44.13 Q6.C
  Top 0.305: CN13.P$1 CN13.P$2 CN13.P$3 CN13.P$4 CN13.P$5 CN13.P$6 CN13.P$7 CN13.P$8 CN13.P$9 CN13.P$10 CN13.P$11 34.29,42.55 35.56,43.81 64.14,43.81 65.72,42.23 67.94,42.23 Q6.C
  Bottom 0.203: D226.C Q6.C
ROW6
  Top 0.203: R23.2 67.94,35.24 Q7.C
  Top 0.305: CN15.P$1 CN15.P$2 CN15.P$3 CN15.P$4 CN15.P$5 CN15.P$6 CN15.P$7 CN15.P$8 CN15.P$9 CN15.P$10 CN15.P$11 34.29,33.66 35.56,34.92 64.14,34.92 65.72,33.34 67.94,33.34 Q7.C
  Bottom 0.203: D229.C Q7.C
ROW7
  Top 0.203: CN17.P$10 CN17.P$11 | R24.2 67.94,26.35 Q8.C
  Top 0.305: CN17.P$1 CN17.P$2 CN17.P$3 CN17.P$4 CN17.P$5 CN17.P$6 CN17.P$7 CN17.P$8 CN17.P$9 CN17.P$10 | CN17.P$11 34.29,24.77 35.56,26.04 64.14,26.04 65.72,24.45 67.94,24.45 Q8.C
  Bottom 0.203: Q8.C D232.C
ROW8
  Top 0.203: R25.2 80.64,88.58 Q9.C
  Top 0.305: CN18.P$1 CN18.P$2 CN18.P$3 CN18.P$4 CN18.P$5 CN18.P$6 CN18.P$7 CN18.P$8 CN18.P$9 CN18.P$10 CN18.P$11
  Bottom 0.203: Q9.C D235.C
  Bottom 0.305: CN18.P$11 80.96,87 Q9.C
ROW9
  Top 0.203: R26.2 80.64,79.69 Q10.C
  Top 0.305: CN21.P$1 CN21.P$2 CN21.P$3 CN21.P$4 CN21.P$5 CN21.P$6 CN21.P$7 CN21.P$8 CN21.P$9 CN21.P$10 CN21.P$11
  Bottom 0.203: Q10.C D238.C
  Bottom 0.305: CN21.P$11 80.96,78.11 Q10.C
ROW10
  Top 0.203: CN23.P$3 CN23.P$4 | R27.2 80.64,70.8 Q11.C
  Top 0.305: CN23.P$1 CN23.P$2 CN23.P$3 | CN23.P$4 CN23.P$5 CN23.P$6 CN23.P$7 CN23.P$8 CN23.P$9 CN23.P$10 CN23.P$11
  Bottom 0.203: Q11.C D241.C
  Bottom 0.305: CN23.P$11 80.96,69.22 Q11.C
ROW11
  Top 0.203: R28.2 80.64,61.91 Q12.C
  Top 0.305: CN25.P$1 CN25.P$2 CN25.P$3 CN25.P$4 CN25.P$5 CN25.P$6 CN25.P$7 CN25.P$8 CN25.P$9 CN25.P$10 CN25.P$11
  Bottom 0.203: Q12.C D244.C
  Bottom 0.305: CN25.P$11 80.96,60.33 Q12.C
ROW12
  Top 0.203: R29.2 80.64,53.02 Q13.C
  Top 0.305: CN27.P$1 CN27.P$2 CN27.P$3 CN27.P$4 CN27.P$5 CN27.P$6 CN27.P$7 CN27.P$8 CN27.P$9 CN27.P$10 CN27.P$11
  Bottom 0.203: Q13.C D247.C
  Bottom 0.305: CN27.P$11 80.96,51.44 Q13.C
ROW13
  Top 0.203: R30.2 80.64,44.13 Q14.C
  Top 0.305: CN29.P$1 CN29.P$2 CN29.P$3 CN29.P$4 CN29.P$5 CN29.P$6 CN29.P$7 CN29.P$8 CN29.P$9 CN29.P$10 CN29.P$11
  Bottom 0.203: Q14.C D250.C
  Bottom 0.305: CN29.P$11 80.96,42.55 Q14.C
ROW14
  Top 0.203: R31.2 80.64,35.24 Q15.C
  Top 0.305: CN31.P$1 CN31.P$2 CN31.P$3 CN31.P$4 CN31.P$5 CN31.P$6 CN31.P$7 CN31.P$8 CN31.P$9 CN31.P$10 CN31.P$11
  Bottom 0.203: Q15.C D253.C
  Bottom 0.305: CN31.P$11 80.96,33.66 Q15.C
ROW15
  Top 0.203: CN33.P$5 CN33.P$6 | CN33.P$9 CN33.P$10 | R32.2 80.64,26.35 Q16.C
  Top 0.305: CN33.P$1 CN33.P$2 CN33.P$3 CN33.P$4 CN33.P$5 | CN33.P$6 CN33.P$7 CN33.P$8 CN33.P$9 | CN33.P$10 CN33.P$11
  Bottom 0.203: D256.C Q16.C
  Bottom 0.305: CN33.P$11 80.96,24.77 Q16.C
SEL0
  Top 0.203: D179.C 58.89,5.71 CN35.P23@1 CN35.P23@2
SEL1
  Top 0.203: D180.C 61.28,5.71 61.28,3.81 | CN35.P24@2 61.43,3.17 61.28,3.17 61.28,3.81 | CN35.P24@1 61.28,3.81
SEL2
  Top 0.203: D198.C 63.97,5.71 CN35.P25@1 CN35.P25@2
SEL3
  Top 0.203: D199.C 66.51,5.71 CN35.P26@1 CN35.P26@2
SEL4
  Top 0.203: D200.C 69.05,5.71 CN35.P27@1 CN35.P27@2
SEL5
  Top 0.203: D201.C 71.59,5.71 CN35.P28@1 CN35.P28@2
SEL6
  Top 0.203: D202.C 74.13,5.71 CN35.P29@1 CN35.P29@2
SEL7
  Top 0.203: D203.C 76.67,5.71 CN35.P30@1 CN35.P30@2
SEL8
  Top 0.203: D204.C 79.21,5.71 CN35.P31@1 CN35.P31@2
SEL9
  Top 0.203: D205.C 81.75,5.71 CN35.P32@1 CN35.P32@2
SEL10
  Top 0.203: D206.C 84.29,5.71 CN35.P33@1 CN35.P33@2
SEL11
  Top 0.203: D207.C 86.83,5.71 CN35.P34@1 CN35.P34@2
SEL12
  Top 0.203: D208.C 89.37,5.71 CN35.P35@1 CN35.P35@2
SEL13
  Top 0.203: D209.C 91.91,5.71 CN35.P36@1 CN35.P36@2
SEL14
  Top 0.203: D210.C 94.45,5.71 CN35.P37@1 CN35.P37@2
SEL15  (1 unrouted)
  Top 0.203: D211.C 96.99,5.71 CN35.P38@1
V+  (16 unrouted)
  Top 1.016: R2.2 R4.2 R5.2 R6.2 R7.2 R8.2 R9.2 R10.2 R11.2 R12.2 R13.2 R14.2 R15.2 R16.2 R17.2 R18.2
  Bottom 1.016: VR1.OUT@2 VR1.OUT@1 36.17,10.46 36.17,13.41 39.42,16.66 54.05,16.66 55.8,18.41 R2.2
VIN
  Top 0.203: CN35.P21@2 CN35.P21@1 | CN35.P22@2 CN35.P22@1
  Bottom 1.016: VR1.IN@1 VR1.IN@2 26.47,7.87 28.85,5.49 54.66,5.49 55.07,5.08 55.07,3.81 | CN35.P21@1 55.07,3.81 | 55.07,3.81 CN35.P22@1

## Text on the board
tPlace: Rev1 | 10 | 9 | 8 | 7 | 6 | 5 | 4 | 3 | 2 | 1 | 0 | 10 | 9 | 8 | 7 | 6 | 5 | 4 | 3 | 2 | 1 | 0 | 0 | 8 | 1 | 9 | 2 | A | 3 | B | 4 | C | 5 | D | 6 | E | 7 | F | SmallRoomLabs | AYTABTU 16 WORD ROM | DB10 | DB9 | DB8 | DB7 | DB6 | DB5 | DB4 | DB3 | DB2 | DB1 | DB0 | CE | V+ | GND | 0